# EAGLE design mm (EAGLE 8.3.1)
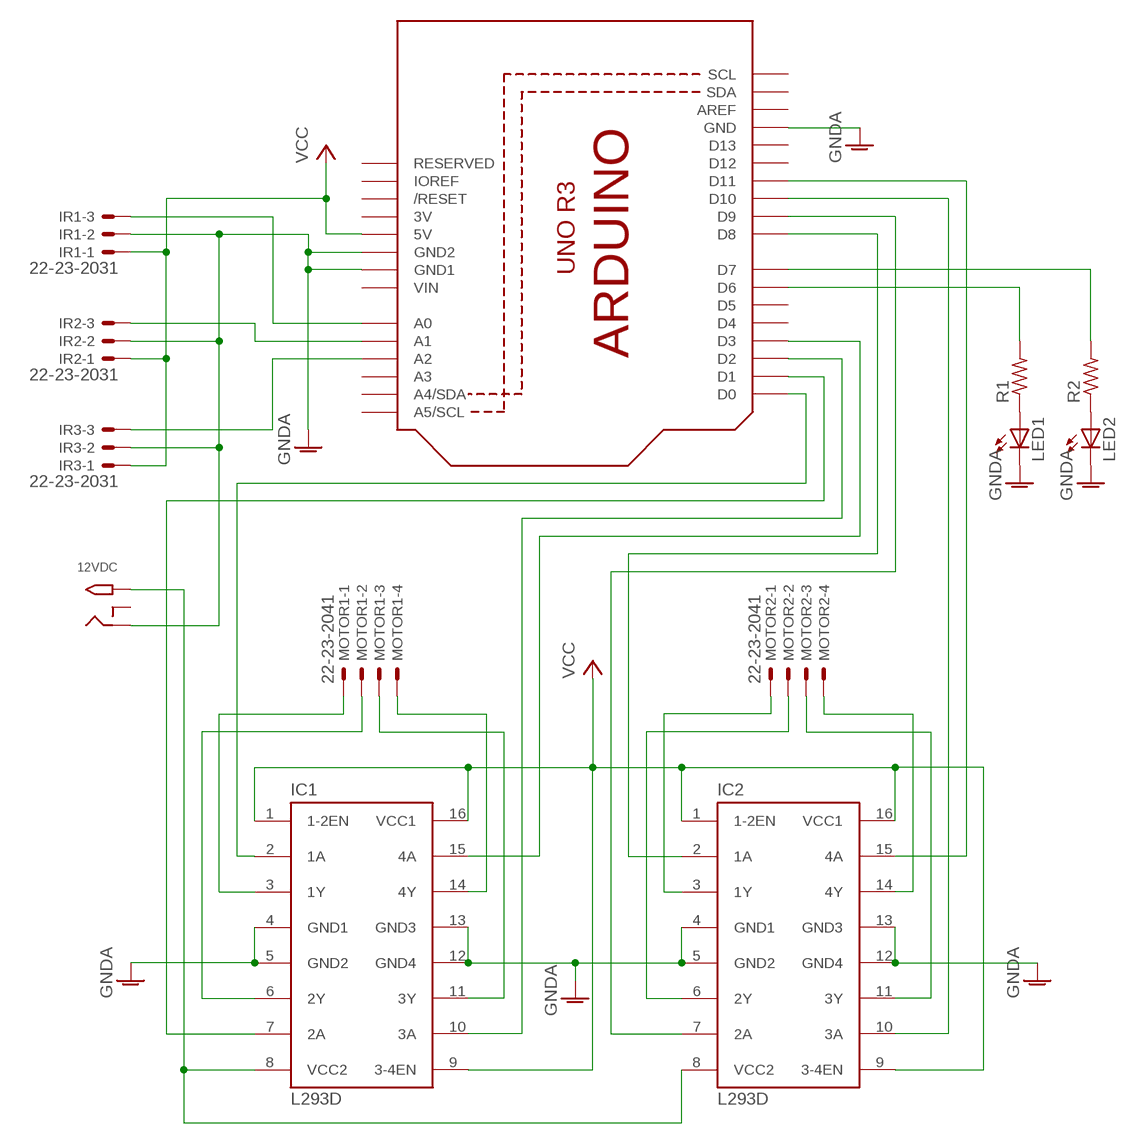
[diagram p0: schematic, sheet 1]

## Parts
12VDC  2.1MMJACKTHM  [PJ-102A]
IC1  L293D  [DIL16]
IC2  L293D  [DIL16]
IR1  22-23-2031  [22-23-2031]
IR2  22-23-2031  [22-23-2031]
IR3  22-23-2031  [22-23-2031]
LED1  LED3MM  [LED3MM]
LED2  LED3MM  [LED3MM]
MOTOR1  22-23-2041  [22-23-2041]
MOTOR2  22-23-2041  [22-23-2041]
R1  R-US_0204/5  [0204/5]
R2  R-US_0204/5  [0204/5]
U1  ARDUINOR3-DIMENSION  [ARDUINOR3]

## Nets
12VDC: 12VDC.TIP IC1.8(VCC2) IC2.8(VCC2)
GNDA: 12VDC.RING IC1.4(GND1) IC1.5(GND2) IC1.12(GND4) IC1.13(GND3) IC2.4(GND1) IC2.5(GND2) IC2.12(GND4) IC2.13(GND3) IR1.2 IR2.2 IR3.2 LED1.K(C) LED2.K(C) U1.GND U1.GND1 U1.GND2
GRAY1: IC1.11(3Y) MOTOR1.3
GRAY2: IC2.11(3Y) MOTOR2.3
GREEN1: IC1.14(4Y) MOTOR1.4
GREEN2: IC2.14(4Y) MOTOR2.4
N$1: IR1.3 U1.A0
N$2: R1.2 U1.D6
N$3: IR2.3 U1.A1
N$4: IC1.2(1A) U1.D0
N$5: R2.2 U1.D7
N$6: LED1.A R1.1
N$8: LED2.A R2.1
N$14: IR3.3 U1.A2
N$15: IC1.10(3A) U1.D2
N$16: IC1.15(4A) U1.D3
N$17: IC2.2(1A) U1.D8
N$18: IC2.7(2A) U1.D9
N$19: IC2.10(3A) U1.D10
N$20: IC1.7(2A) U1.D1
N$21: IC2.15(4A) U1.D11
RED1: IC1.3(1Y) MOTOR1.1
RED2: IC2.3(1Y) MOTOR2.1
VCC: IC1.1(1-2EN) IC1.9(3-4EN) IC1.16(VCC1) IC2.1(1-2EN) IC2.9(3-4EN) IC2.16(VCC1) IR1.1 IR2.1 IR3.1 U1.5V
YELLOW1: IC1.6(2Y) MOTOR1.2
YELLOW2: IC2.6(2Y) MOTOR2.2
Unconnected: 12VDC.RING_SW U1.A3 U1.A4(A4/SDA) U1.A5(A5/SCL) U1.AREF U1.D4 U1.D5 U1.D12 U1.D13 U1.IOREF U1.RESERVED U1.RESET(/RESET) U1.SCL U1.SDA

## Power pins joined to a net without a drawn wire
3V: U1.3V
VIN: U1.VIN

## Library data of the parts
12VDC = adafruit:2.1MMJACK: 2.1mm x 5.5mm THM DC jack with internal switch. Digikey part #PJ-102A, 4UCON part #05537 2.1mm x 5.5mm SMT DC jack with internal switch. Digikey part #PJ-002A-SMT, 4UCON part #03267 By microbuilder.eu & adafruit.com
IC1 IC2 = st-microelectronics:L293D: PUSH-PULL 4 CHANNEL DRIVER; MPN: L293D; OC_FARNELL: 9589619; OC_NEWARK: 56P8249
IR1-IR3 = con-molex:22-23-2031: .100" (2.54mm) Center Header - 3 Pin; MF: MOLEX; MPN: 22-23-2031; OC_FARNELL: 1462950; OC_NEWARK: 30C0862
LED1 LED2 = adafruit:LED: LED OSRAM: - CHIPLED LG R971, LG N971, LY N971, LG Q971, LY Q971, LO R971, LY R971 LH N974, LH R974 LS Q976, LO Q976, LY Q976 LO Q996 - Hyper CHIPLED LW Q18S LB Q993, LB Q99A, LB R99A - SideLED LS A670, LO A670, LY A670, LG A670, LP A670 LB A673, LV A673, LT A673, LW A673 LH A674 LY A675 LS A676, LA A676, LO A676, LY A676, LW A676 LS A679, LY A679, LG A679 - Hyper Micro SIDELED® LS Y876, LA Y876, LO Y876, LY Y876 LT Y87S - SmartLED LW L88C, LW L88S LB L89C, LB L89S, LG L890 LS L89K, LO L89K, LY L89K LS L896, LA L896, LO L896, LY L896 - TOPLED LS T670, LO T670, LY T670, LG T670, LP T670 LSG T670, LSP T670, LSY T670, LOP T670, LYG T670 LG T671, LOG T671, LSG T671 LB T673, LV T673, LT T673, LW T673 LH T674 LS T676, LA T676, LO T676, LY T676, LB T676, LH T676, LSB T676, LW T676 LB T67C, LV T67C, LT T67C, LS T67K, LO T67K, LY T67K, LW E67C LS E67B, LA E67B, LO E67B, LY E67B, LB E67C, LV E67C, LT E67C LW T67C LS T679, LY T679, LG T679 LS T770, LO T770, LY T770, LG T770, LP T770 LB T773, LV T773, LT T773, LW T773 LH T774 LS E675, LA E675, LY E675, LS T675 LS T776, LA T776, LO T776, LY T776, LB T776 LHGB T686 LT T68C, LB T68C - Hyper Mini TOPLED® LB M676 - Mini TOPLED Santana® LG M470 LS M47K, LO M47K, LY M47K Source: http://www.osram.convergy.de/
MOTOR1 MOTOR2 = con-molex:22-23-2041: .100" (2.54mm) Center Header - 4 Pin; MF: MOLEX; MPN: 22-23-2041; OC_FARNELL: 1462920; OC_NEWARK: 38C0355
R1 R2 = resistor:R-US_: RESISTOR, American symbol
U1 = adafruit:ARDUINOR3: This is a new object for the new Arduino R3 - with extra pins that you may want to use (such as IOref, and duplicated A4/A5

## Net classes
0 default: width 0.254 mm, drill 0.508 mm, clearance 0.254 mm

## Board
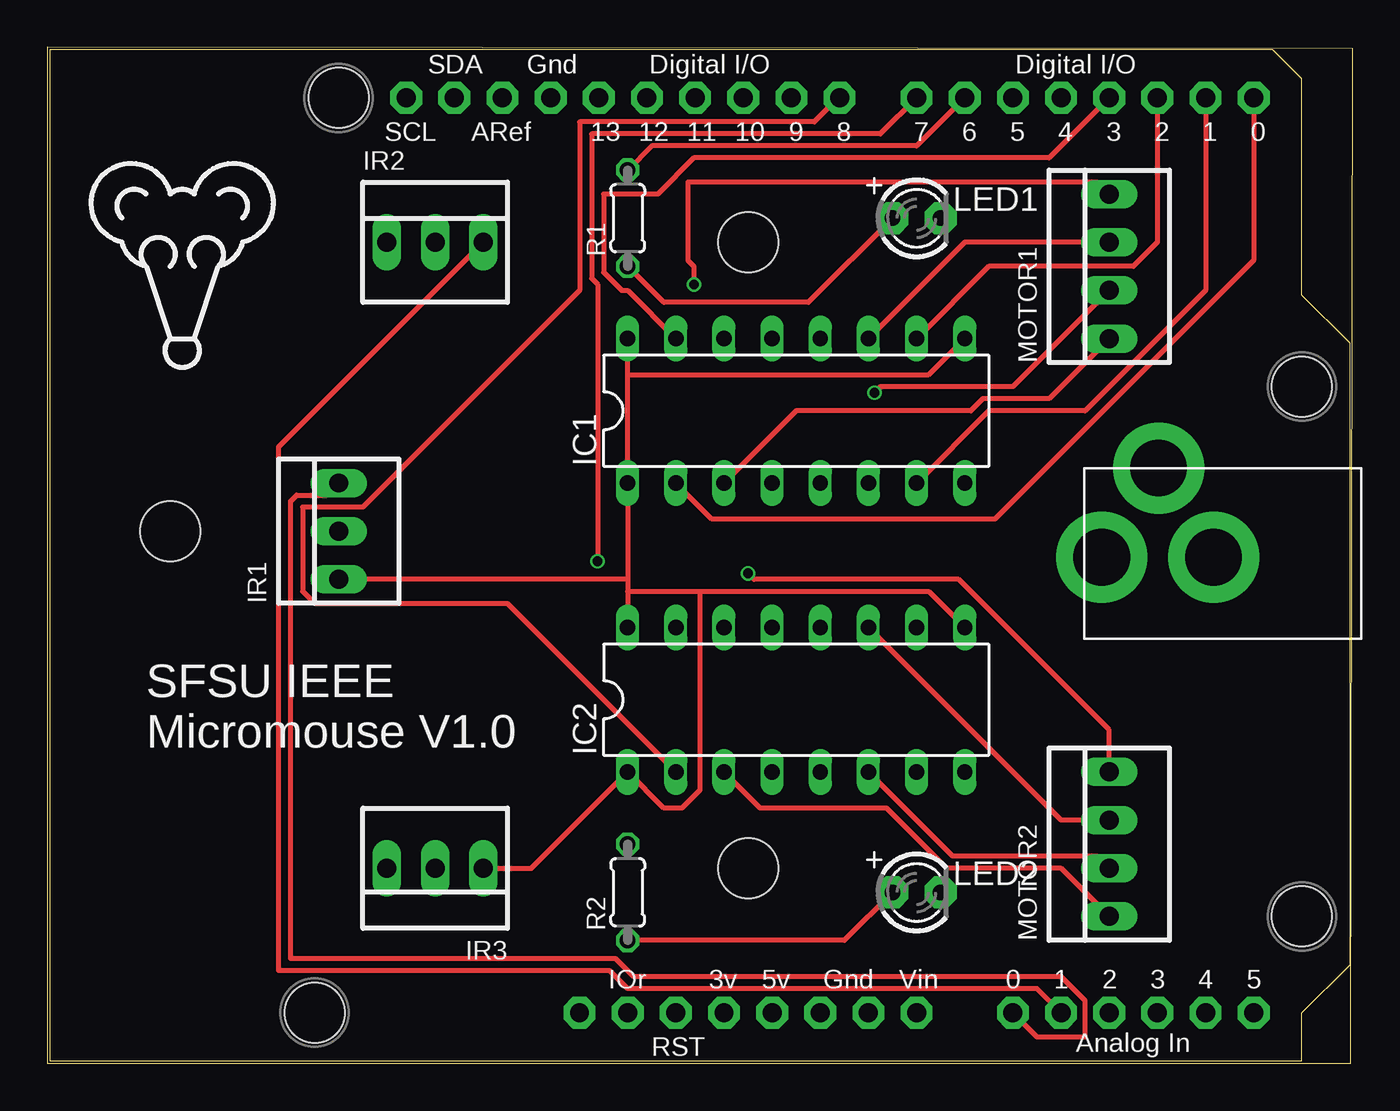
[diagram p1: board, top side]
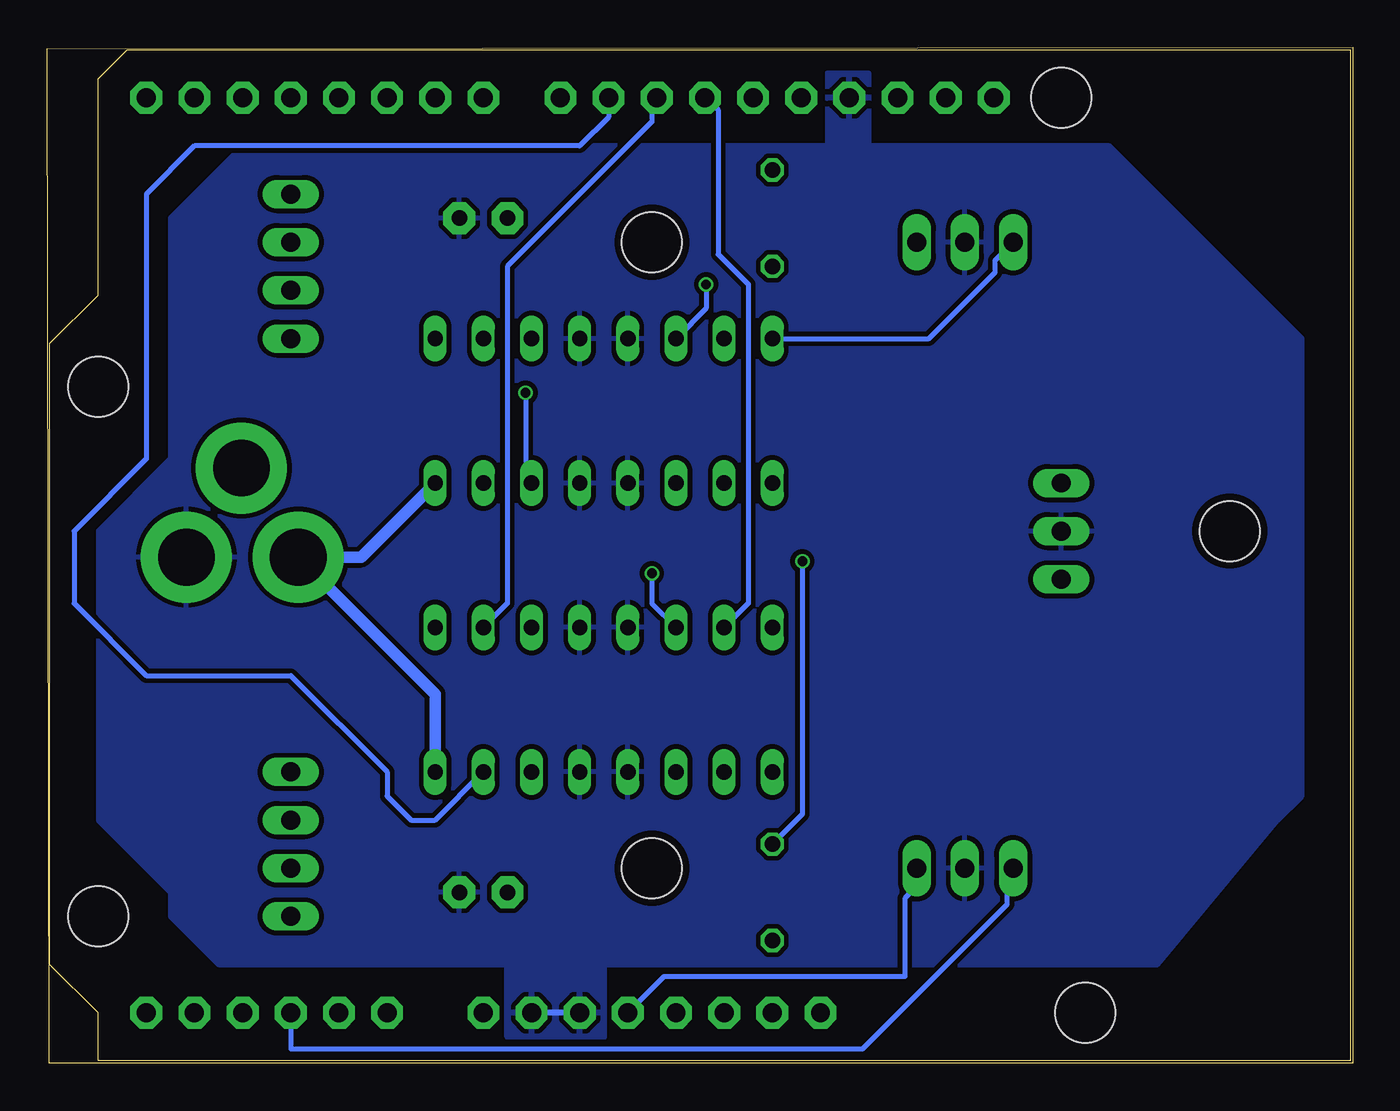
[diagram p2: board, bottom side, seen from below]

Size 68.84 x 53.58 mm. Coordinates in mm from the lower left corner, seen from the top.
Outline: 0,0 68.76,0 68.84,53.52 0,53.58 0,0
Copper layers (1*16): Top 0.035559375mm / dielectric 1.6mm / Bottom 0.035559375mm
Design rules "oshpark-2layer": minimum track width 6mil, minimum drill 10mil, track to track 6mil, track to pad 6mil, pad to pad 6mil, via to via 6mil, smd to smd 6mil, copper to edge 15mil, drill to drill 6mil, minimum pad ring 5mil, minimum via ring 5mil, stop-mask expansion 2.5mil, vias tented up to drill 0mil, thermal gap 10mil
Holes 3.17 mm at 6.48,28.07 36.96,10.29 36.96,43.31 14.1,2.67 15.37,50.93 66.17,35.69 66.17,7.75

### Footprints (pad centres in the part's own frame; a part is rotated, then mirrored left to right if it is on the bottom)
PJ-102A = drill 3 pad 4.8: RING 0.1,-3.39; RING_SW -4.6,-6.29; TIP 0.1,-9.29
DIL16 = drill 0.813 long: 1 -8.89,-3.81; 2 -6.35,-3.81; 3 -3.81,-3.81; 4 -1.27,-3.81; 5 1.27,-3.81; 6 3.81,-3.81; 7 6.35,-3.81; 8 8.89,-3.81; 9 8.89,3.81; 10 6.35,3.81; 11 3.81,3.81; 12 1.27,3.81; 13 -1.27,3.81; 14 -3.81,3.81; 15 -6.35,3.81; 16 -8.89,3.81
22-23-2031 = drill 1 long: 1 -2.54,0; 2 0,0; 3 2.54,0
LED3MM = drill 0.813 pad 1.676 octagon: A -1.27,0; K 1.27,0
22-23-2041 = drill 1 long: 1 -3.81,0; 2 -1.27,0; 3 1.27,0; 4 3.81,0
0204/5 = drill 0.813 octagon: 1 -2.54,0; 2 2.54,0
ARDUINOR3 = drill 1 pad 1.676 octagon: 3V 35.56,2.54; 5V 38.1,2.54; A0 50.8,2.54; A1 53.34,2.54; A2 55.88,2.54; A3 58.42,2.54; A4 60.96,2.54; A5 63.5,2.54; AREF 23.876,50.8; D0 63.5,50.8; D1 60.96,50.8; D2 58.42,50.8; D3 55.88,50.8; D4 53.34,50.8; D5 50.8,50.8; D6 48.26,50.8; D7 45.72,50.8; D8 41.656,50.8; D9 39.116,50.8; D10 36.576,50.8; D11 34.036,50.8; D12 31.496,50.8; D13 28.956,50.8; GND 26.416,50.8; GND1 43.18,2.54; GND2 40.64,2.54; IOREF 30.48,2.54; RESERVED 27.94,2.54; RESET 33.02,2.54; SCL 18.796,50.8; SDA 21.336,50.8; VIN 45.72,2.54

### Placement (x,y rotation side)
12VDC  64.9,26.8 270 top
IC1  39.5,34.42 0 top
IC2  39.5,19.18 0 top
IR1  15.37,28.07 90 top
IR2  20.45,43.31 0 top
IR3  20.45,10.29 180 top
LED1  45.85,44.58 0 top
LED2  45.85,9.02 0 top
MOTOR1  56.01,42.04 90 top
MOTOR2  56.01,11.56 90 top
R1  30.61,44.58 90 top
R2  30.61,9.02 90 top
U1  0.13,0.13 0 top

### Tracks (layer width: path | path; a pad name or v marks a point on that pad's centre or on a via)
12VDC
  Bottom 0.61: IC2.8 48.39,19.48 12VDC.TIP 52.3,26.7 IC1.8
GNDA
  Bottom 0.305: U1.GND2 U1.GND1
  pour Bottom: 59.82,5.21 10.29,5.21 3.94,12.83 2.67,14.1 2.67,38.23 12.83,48.39 58.55,48.39 62.36,44.58 62.36,31.88 66.17,28.07 66.17,12.83 62.36,9.02 62.36,7.75
  pour Bottom: 39.5,5.21 39.5,1.4 44.58,1.4 44.58,5.21
  pour Bottom: 25.53,48.39 25.53,52.2 27.69,52.2 27.69,48.39
GRAY1
  Top 0.254: IC1.11 48.39,43.31 MOTOR1.3
GRAY2
  Top 0.254: IC2.11 53.47,12.83 MOTOR2.3
GREEN1  (via drill 0.51)
  Top 0.254: v34.1,41.09 34.1,42.04 33.78,42.36 33.78,46.48 55.37,46.48 MOTOR1.4
  Bottom 0.254: IC1.14 34.1,39.81 v34.1,41.09
GREEN2  (via drill 0.51)
  Top 0.254: v36.96,25.84 37.28,25.53 48.07,25.53 56.01,17.59 MOTOR2.4
  Bottom 0.254: IC2.14 36.96,24.26 v36.96,25.84
N$1
  Top 0.254: IR1.3 14.73,29.97 13.14,29.97 12.83,29.66 12.83,5.53 29.97,5.53 30.93,4.57 53.47,4.57 54.74,3.3 54.74,1.4 52.2,1.4 U1.A0
N$2
  Top 0.254: R1.2 31.88,48.39 45.85,48.39 U1.D6
N$3
  Top 0.254: IR2.3 12.19,32.51 12.19,4.89 29.65,4.89 30.61,3.94 52.2,3.94 U1.A1
N$4
  Top 0.254: IC1.2 35.05,28.7 49.98,28.7 63.63,42.36 U1.D0
N$5  (via drill 0.51)
  Top 0.254: v29.02,26.48 29.02,41.09 28.7,41.4 28.7,49.02 43.94,49.02 U1.D7
  Bottom 0.254: R2.2 29.02,13.14 v29.02,26.48
N$6
  Top 0.254: R1.1 32.51,40.13 40.13,40.13 LED1.A
N$8
  Top 0.254: R2.1 42.04,6.48 LED2.A
N$14
  Bottom 0.254: IR3.3 18.22,9.97 18.22,8.38 25.84,0.76 56.01,0.76 U1.A2
N$15
  Top 0.254: IC1.10 49.66,42.04 57.28,42.04 58.55,43.31 U1.D2
N$16
  Top 0.254: IC1.15 30.61,40.77 30.29,40.77 29.34,41.72 29.34,45.85 32.2,45.85 34.1,47.75 52.83,47.75 U1.D3
N$17
  Top 0.254: IC2.2 24.26,24.26 14.1,24.26 13.46,24.89 13.46,29.34 16.64,29.34 28.07,40.77 28.07,49.66 40.45,49.66 41.72,50.93 U1.D8
N$18
  Bottom 0.254: U1.D9 39.24,49.91 40.77,48.39 61.09,48.39 63.63,45.85 63.63,31.88 67.44,28.07 67.44,24.26 63.63,20.45 56.01,20.45 50.93,15.37 50.93,14.1 49.66,12.83 48.39,12.83 IC2.7
N$19
  Bottom 0.254: IC2.10 44.58,24.26 44.58,42.04 36.96,49.66 36.96,50.93 U1.D10
N$20
  Top 0.254: IC1.7 49.66,34.42 54.74,34.42 61.09,40.77 U1.D1
N$21
  Bottom 0.254: IC2.15 31.88,24.26 31.88,41.09 33.46,42.67 33.46,50.29 34.1,50.93 U1.D11
RED1
  Top 0.254: IC1.3 39.5,34.42 48.7,34.42 49.34,35.05 52.83,35.05 MOTOR1.1
RED2
  Top 0.254: IC2.3 37.59,13.46 44.26,13.46 47.43,10.29 53.47,10.29 MOTOR2.1
VCC
  Top 0.254: IR3.1 25.53,10.29 IC2.1 32.51,13.46 33.46,13.46 34.42,14.41 34.42,24.89 | 30.61,25.53 IC1.1 30.61,36.32 | 30.61,25.53 30.61,24.89 | 30.61,24.89 IC2.16 | IC2.9 46.48,24.89 34.42,24.89 | 30.61,24.89 34.42,24.89 | 30.61,36.32 IC1.16 | IC1.9 46.48,36.32 30.61,36.32 | 30.61,25.53 IR1.1
  Bottom 0.254: U1.5V 36.32,4.57 23.62,4.57 23.62,8.7 22.99,9.34 IR3.1 | IR2.1 18.86,42.36 18.86,41.72 22.35,38.23 IC1.16
YELLOW1  (via drill 0.51)
  Top 0.254: v43.62,35.37 43.94,35.69 50.93,35.69 MOTOR1.2
  Bottom 0.254: IC1.6 43.62,30.92 v43.62,35.37
YELLOW2
  Top 0.254: IC2.6 47.75,10.92 55.37,10.92 MOTOR2.2

### Text on the board
tNames: SFSU IEEE / Micromouse V1.0